# EAGLE design sousvide (EAGLE 7.6.0)
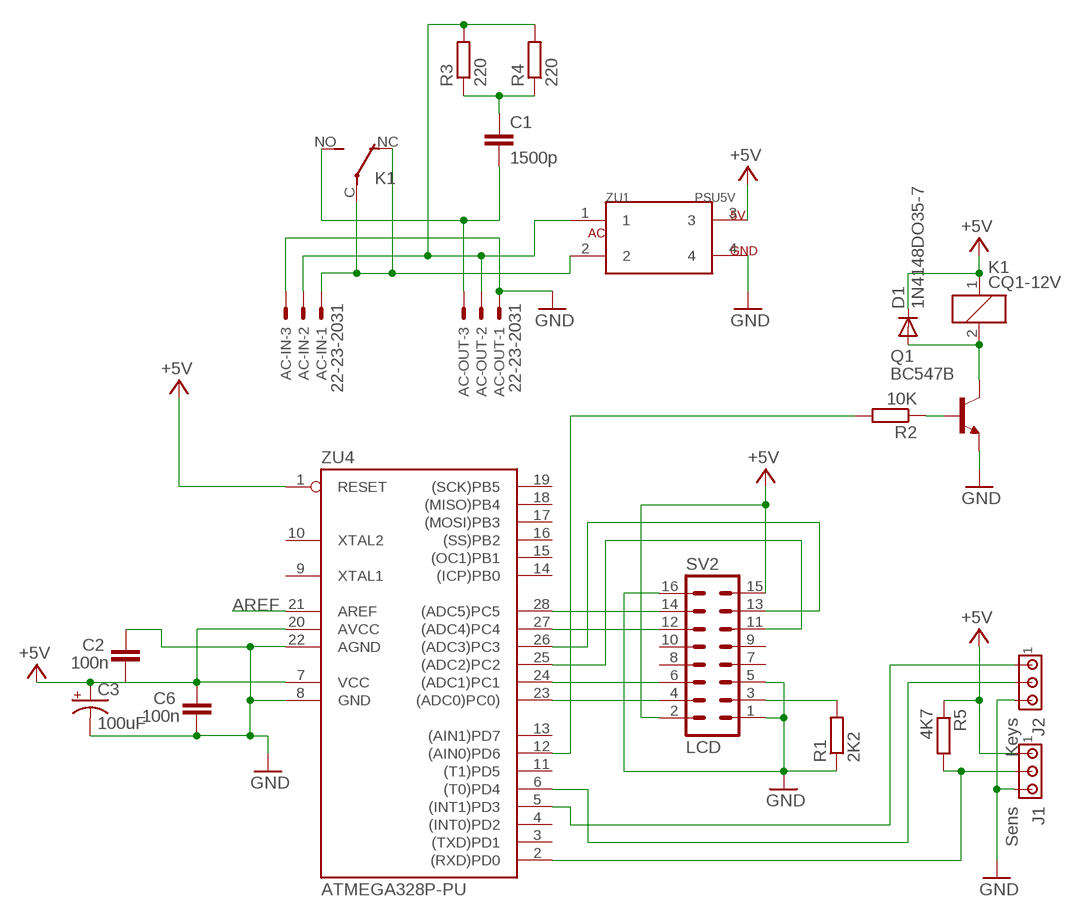
[diagram p0: schematic, sheet 1]

## Parts
AC-IN  22-23-2031  [22-23-2031]
AC-OUT  22-23-2031  [22-23-2031]
C1  1500p  C7.5/4  [C7.5B4]
C2  100n  C-EU025-025X050  [C025-025X050]
C3  100uF  CPOL-USE2.5-5  [E2,5-5]
C6  100n  C-EU025-025X050  [C025-025X050]
D1  1N4148DO35-7  [DO35-7]
J1  Sens  MTA03-100  [10X03MTA]
J2  Keys  MTA03-100  [10X03MTA]
K1  CQ1-12V  [CQ1]
Q1  BC547B  [TO92]
R1  2K2  R-EU_0204/7  [0204/7]
R2  10K  R-EU_0204/7  [0204/7]
R3  220  R-EU_0204/7  [0204/7]
R4  220  R-EU_0204/7  [0204/7]
R5  4K7  R-EU_0204/7  [0204/7]
SV2  LCD  ML16  [ML16]
ZU1  PSU5V  [USBPSU1]
ZU4  ATMEGA328P-PU  [DIL28-3]

## Nets
+5V [usbvcc]: C2.1 C3.+ C6.2 D1.C J1.1 K1.1 R5.1 SV2.2 SV2.15 ZU1.3 ZU4.1(RESET) ZU4.7(VCC) ZU4.20(AVCC)
AREF [aref]: ZU4.21(AREF)
GND [gnd]: AC-IN.3 AC-OUT.1 C2.2 C3.- C6.1 J1.3 J2.3 Q1.1(E) R1.1 SV2.1 SV2.5 SV2.16 ZU1.4 ZU4.8(GND) ZU4.22(AGND)
N$1: SV2.14 ZU4.28((ADC5)PC5)
N$2: SV2.12 ZU4.27((ADC4)PC4)
N$3: Q1.2(B) R2.1
N$4: D1.A K1.2 Q1.3(C)
N$5: AC-IN.1 K1.C(2:P) K1.NC(2:O) ZU1.2
N$7: AC-OUT.3 C1.2 K1.NO(2:S)
N$8: C1.1 R3.1 R4.1
N$9: SV2.6 ZU4.24((ADC1)PC1)
N$10: AC-IN.2 AC-OUT.2 R3.2 R4.2 ZU1.1
N$11: SV2.4 ZU4.23((ADC0)PC0))
N$12: SV2.13 ZU4.26((ADC3)PC3)
N$13: SV2.11 ZU4.25((ADC2)PC2)
N$14: J1.2 R5.2 ZU4.2((RXD)PD0)
N$15: J2.2 ZU4.6((T0)PD4)
N$16: J2.1 ZU4.5((INT1)PD3)
N$17: R1.2 SV2.3
N$18: R2.2 ZU4.12((AIN0)PD6)
Unconnected: SV2.7 SV2.8 SV2.9 SV2.10 ZU4.3((TXD)PD1) ZU4.4((INT0)PD2) ZU4.9(XTAL1) ZU4.10(XTAL2) ZU4.11((T1)PD5) ZU4.13((AIN1)PD7) ZU4.14((ICP)PB0) ZU4.15((OC1)PB1) ZU4.16((SS)PB2) ZU4.17((MOSI)PB3) ZU4.18((MISO)PB4) ZU4.19((SCK)PB5)

## Library data of the parts
AC-IN AC-OUT = con-molex:22-23-2031: .100" (2.54mm) Center Header - 3 Pin; MF: MOLEX; MPN: 22-23-2031; OC_FARNELL: 1462950; OC_NEWARK: 30C0862
C1 = capacitor-wima:C: CAPACITOR naming: grid - package width
C2 C6 = rcl:C-EU: CAPACITOR, European symbol
C3 = rcl:CPOL-US: POLARIZED CAPACITOR, American symbol
D1 = diode:1N4148: DIODE high speed (Philips)
J1 J2 = con-amp:MTA03-100: AMP connector
K1 = relay:CQ1-12V: AUTOMOTIVE QUIET RELAY NAiS Source: http://www.mew-europe.com/.. en_ds_61208_0000.pdf; OC_FARNELL: unknown; OC_NEWARK: unknown
Q1 = transistor-npn:BC547*: NPN Transistor
R1-R5 = resistor:R-EU_: RESISTOR, European symbol
SV2 = con-ml:ML16: HARTING; OC_FARNELL: unknown; OC_NEWARK: unknown
ZU1 = mylib:PSU5V: 220 VAC to 5V 1A
ZU4 = SmartPrj:ATMEGA328P-: MICROCONTROLLER 4 Kbytes FLASH 128 bytes SRAM 256 bytes EEPROM UART 6-channel 10 bit ADC

## Net classes
0 default: width 0.254 mm, clearance 0.254 mm
1 power: width 0.61 mm, drill 0.61 mm, clearance 0.254 mm
2 gnd: width 0.305 mm, drill 0.559 mm, clearance 0.254 mm
3 usbvcc: width 0.508 mm, drill 0.61 mm, clearance 0.254 mm
4 aref: width 0.406 mm, drill 0.61 mm, clearance 0.254 mm

## Board
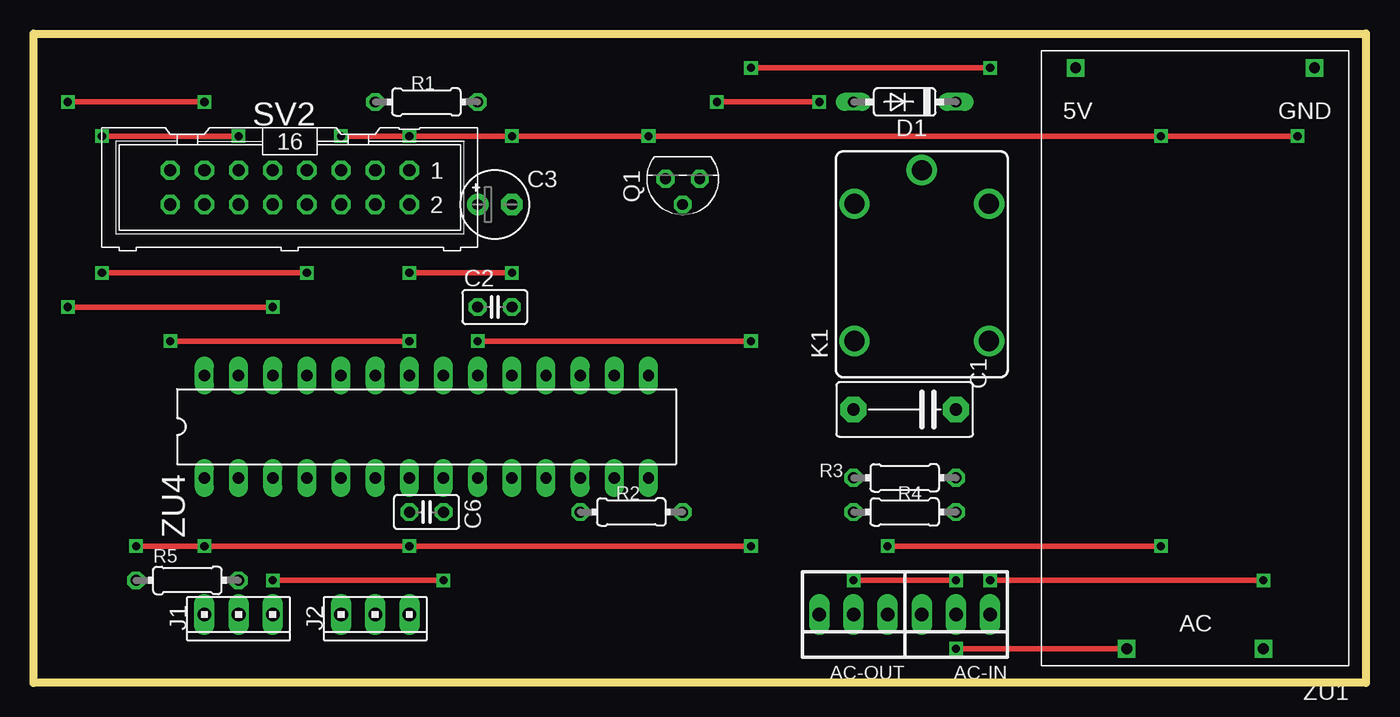
[diagram p1: board, top side]
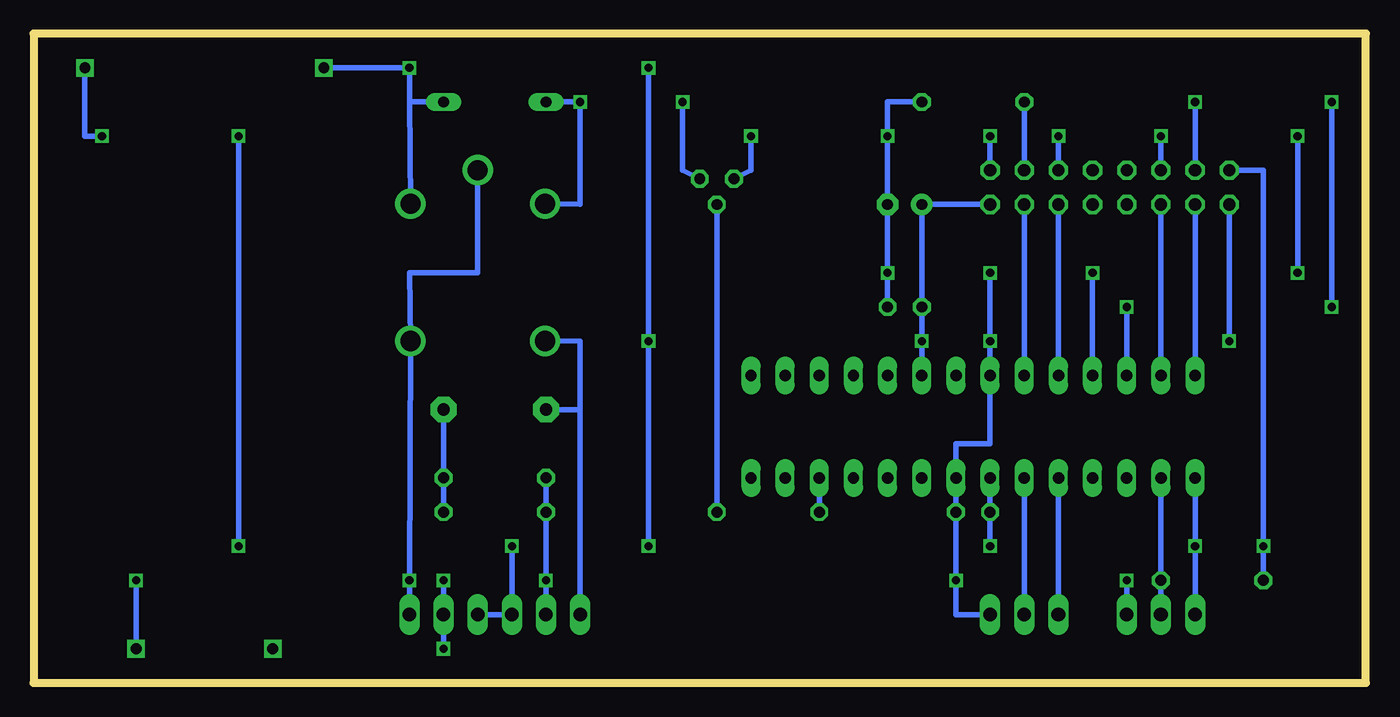
[diagram p2: board, bottom side, seen from below]

Size 99.06 x 48.26 mm. Coordinates in mm from the lower left corner, seen from the top.
Outline: 0,0 0,48.26 99.06,48.26 99.06,0 0,0
Copper layers (1*16): Top 0.035mm / dielectric 1.5mm / Bottom 0.035mm
Design rules "default *": minimum track width 16mil, minimum drill 24mil, track to track 8mil, track to pad 8mil, pad to pad 8mil, via to via 8mil, smd to smd 8mil, copper to edge 40mil, drill to drill 8mil, minimum pad ring 10mil, minimum via ring 8mil, stop-mask expansion 4mil, vias tented up to drill 0mil, thermal gap 10mil

### Footprints (pad centres in the part's own frame; a part is rotated, then mirrored left to right if it is on the bottom)
22-23-2031 = drill 1 long: 1 -2.54,0; 2 0,0; 3 2.54,0
C7.5B4 = drill 0.914 pad 1.905 octagon: 1 -3.81,0; 2 3.81,0
C025-025X050 = drill 0.813 octagon: 1 -1.27,0; 2 1.27,0
E2,5-5 = drill 0.813 pad 1.6: + -1.27,0 | drill 0.813 pad 1.6 octagon: - 1.27,0
DO35-7 = drill 0.813 long: A 3.81,0; C -3.81,0
10X03MTA = drill 1.016 long: 1 2.54,0; 2 0,0; 3 -2.54,0
CQ1 = drill 1.5: 1 4.5,-5; 2 4.5,5; C 7,0; NC -5.7,-5; NO -5.7,5
TO92 = drill 0.813 octagon: 1 1.27,0; 2 0,1.905; 3 -1.27,0
0204/7 = drill 0.813 octagon: 1 -3.81,0; 2 3.81,0
ML16 = drill 0.914 octagon: 1 -8.89,-1.27; 2 -8.89,1.27; 3 -6.35,-1.27; 4 -6.35,1.27; 5 -3.81,-1.27; 6 -3.81,1.27; 7 -1.27,-1.27; 8 -1.27,1.27; 9 1.27,-1.27; 10 1.27,1.27; 11 3.81,-1.27; 12 3.81,1.27; 13 6.35,-1.27; 14 6.35,1.27; 15 8.89,-1.27; 16 8.89,1.27
USBPSU1 = drill 0.8 square: 1 16.51,-1.27; 2 6.35,-1.27; 3 20.32,-44.45; 4 2.54,-44.45
DIL28-3 = drill 0.85 pad 1.422 long: 1 -16.51,-3.81; 2 -13.97,-3.81; 3 -11.43,-3.81; 4 -8.89,-3.81; 5 -6.35,-3.81; 6 -3.81,-3.81; 7 -1.27,-3.81; 8 1.27,-3.81; 9 3.81,-3.81; 10 6.35,-3.81; 11 8.89,-3.81; 12 11.43,-3.81; 13 13.97,-3.81; 14 16.51,-3.81; 15 16.51,3.81; 16 13.97,3.81; 17 11.43,3.81; 18 8.89,3.81; 19 6.35,3.81; 20 3.81,3.81; 21 1.27,3.81; 22 -1.27,3.81; 23 -3.81,3.81; 24 -6.35,3.81; 25 -8.89,3.81; 26 -11.43,3.81; 27 -13.97,3.81; 28 -16.51,3.81

### Placement (x,y rotation side)
AC-IN  68.58,5.08 180 top
AC-OUT  60.96,5.08 180 top
C1  64.77,20.32 180 top
C2  34.29,27.94 0 top
C3  34.29,35.56 0 top
C6  29.21,12.7 180 top
D1  64.77,43.18 180 top
J1  15.24,5.08 180 top
J2  25.4,5.08 180 top
K1  66.04,31.11 90 top
Q1  48.26,37.47 180 top
R1  29.21,43.18 180 top
R2  44.45,12.7 180 top
R3  64.77,15.24 180 top
R4  64.77,12.7 180 top
R5  11.43,7.62 0 top
SV2  19.05,36.83 180 top
ZU1  97.79,1.27 180 top
ZU4  29.21,19.05 0 top

### Tracks (layer width: path | path; a pad name or v marks a point on that pad's centre or on a via)
+5V  (via drill 0.6)
  Top 0.406: v7.62,10.16 v12.7,10.16 v27.94,10.16 v53.34,10.16 | v33.02,25.4 v53.34,25.4 | v53.34,45.72 v71.12,45.72
  Bottom 0.406: J1.1 v12.7,10.16 ZU4.1 | ZU4.20 v33.02,25.4 C2.1 C3.+ SV2.2 | C6.2 ZU4.7 v27.94,10.16 | SV2.15 7.62,38.1 v7.62,10.16 R5.1 | ZU1.3 v71.12,45.72 71.12,43.18 | v53.34,45.72 v53.34,25.4 v53.34,10.16 | 71.12,43.18 K1.1 | D1.C 71.12,43.18
GND  (via drill 0.6)
  Top 0.406: v27.94,30.48 v35.56,30.48 | v10.16,25.4 v27.94,25.4 | v22.86,40.64 v27.94,40.64 v35.56,40.64 v45.72,40.64 v83.82,40.64 v93.98,40.64 | v17.78,7.62 v30.48,7.62 | v63.5,10.16 v83.82,10.16
  Bottom 0.406: J2.3 30.48,5.08 v30.48,7.62 C6.1 ZU4.8 30.48,17.78 27.94,17.78 ZU4.22 v27.94,25.4 v27.94,30.48 | SV2.1 v27.94,40.64 | SV2.16 v10.16,25.4 | SV2.5 v22.86,40.64 | Q1.1 45.72,38.1 v45.72,40.64 | ZU1.4 95.25,40.64 v93.98,40.64 | J1.3 v17.78,7.62 | R1.1 35.56,43.18 v35.56,40.64 C3.- v35.56,30.48 C2.2 | AC-IN.3 AC-OUT.1 v63.5,10.16 | v83.82,10.16 v83.82,40.64
N$1
  Bottom 0.406: ZU4.28 SV2.14
N$2
  Bottom 0.406: ZU4.27 SV2.12
N$3
  Bottom 0.406: R2.1 Q1.2
N$4  (via drill 0.6)
  Top 0.406: v50.8,43.18 v58.42,43.18
  Bottom 0.406: Q1.3 50.8,38.1 v50.8,43.18 | D1.A v58.42,43.18 58.42,35.56 K1.2
N$5  (via drill 0.6)
  Top 0.406: v71.12,7.62 v91.44,7.62
  Bottom 0.406: AC-IN.1 v71.12,7.62 K1.NC 71.12,30.48 66.04,30.48 K1.C | v91.44,7.62 ZU1.2
N$7
  Bottom 0.406: AC-OUT.3 58.42,20.32 | 58.42,20.32 C1.2 | K1.NO 58.42,25.4 58.42,20.32
N$8
  Bottom 0.406: R4.1 R3.1 C1.1
N$9
  Bottom 0.406: ZU4.24 SV2.6
N$10  (via drill 0.6)
  Top 0.406: v68.58,7.62 v60.96,7.62 | v68.58,2.54 ZU1.1
  Bottom 0.406: R3.2 R4.2 v60.96,7.62 AC-OUT.2 | v68.58,7.62 AC-IN.2 v68.58,2.54
N$11
  Bottom 0.406: ZU4.23 SV2.4
N$12  (via drill 0.6)
  Top 0.406: v17.78,27.94 v2.54,27.94 | v2.54,43.18 v12.7,43.18
  Bottom 0.406: ZU4.26 v17.78,27.94 | v2.54,27.94 v2.54,43.18 | v12.7,43.18 SV2.13
N$13  (via drill 0.6)
  Top 0.406: v20.32,30.48 v5.08,30.48 | v5.08,40.64 v15.24,40.64
  Bottom 0.406: ZU4.25 v20.32,30.48 | v5.08,30.48 v5.08,40.64 | v15.24,40.64 SV2.11
N$14
  Bottom 0.406: ZU4.2 R5.2 J1.2
N$15
  Bottom 0.406: J2.2 ZU4.6
N$16
  Bottom 0.406: J2.1 ZU4.5
N$17
  Bottom 0.406: R1.2 SV2.3
N$18
  Bottom 0.406: R2.2 ZU4.12